# Altium project CPC-UNIFEI.PrjPcb (part 1 of 4)
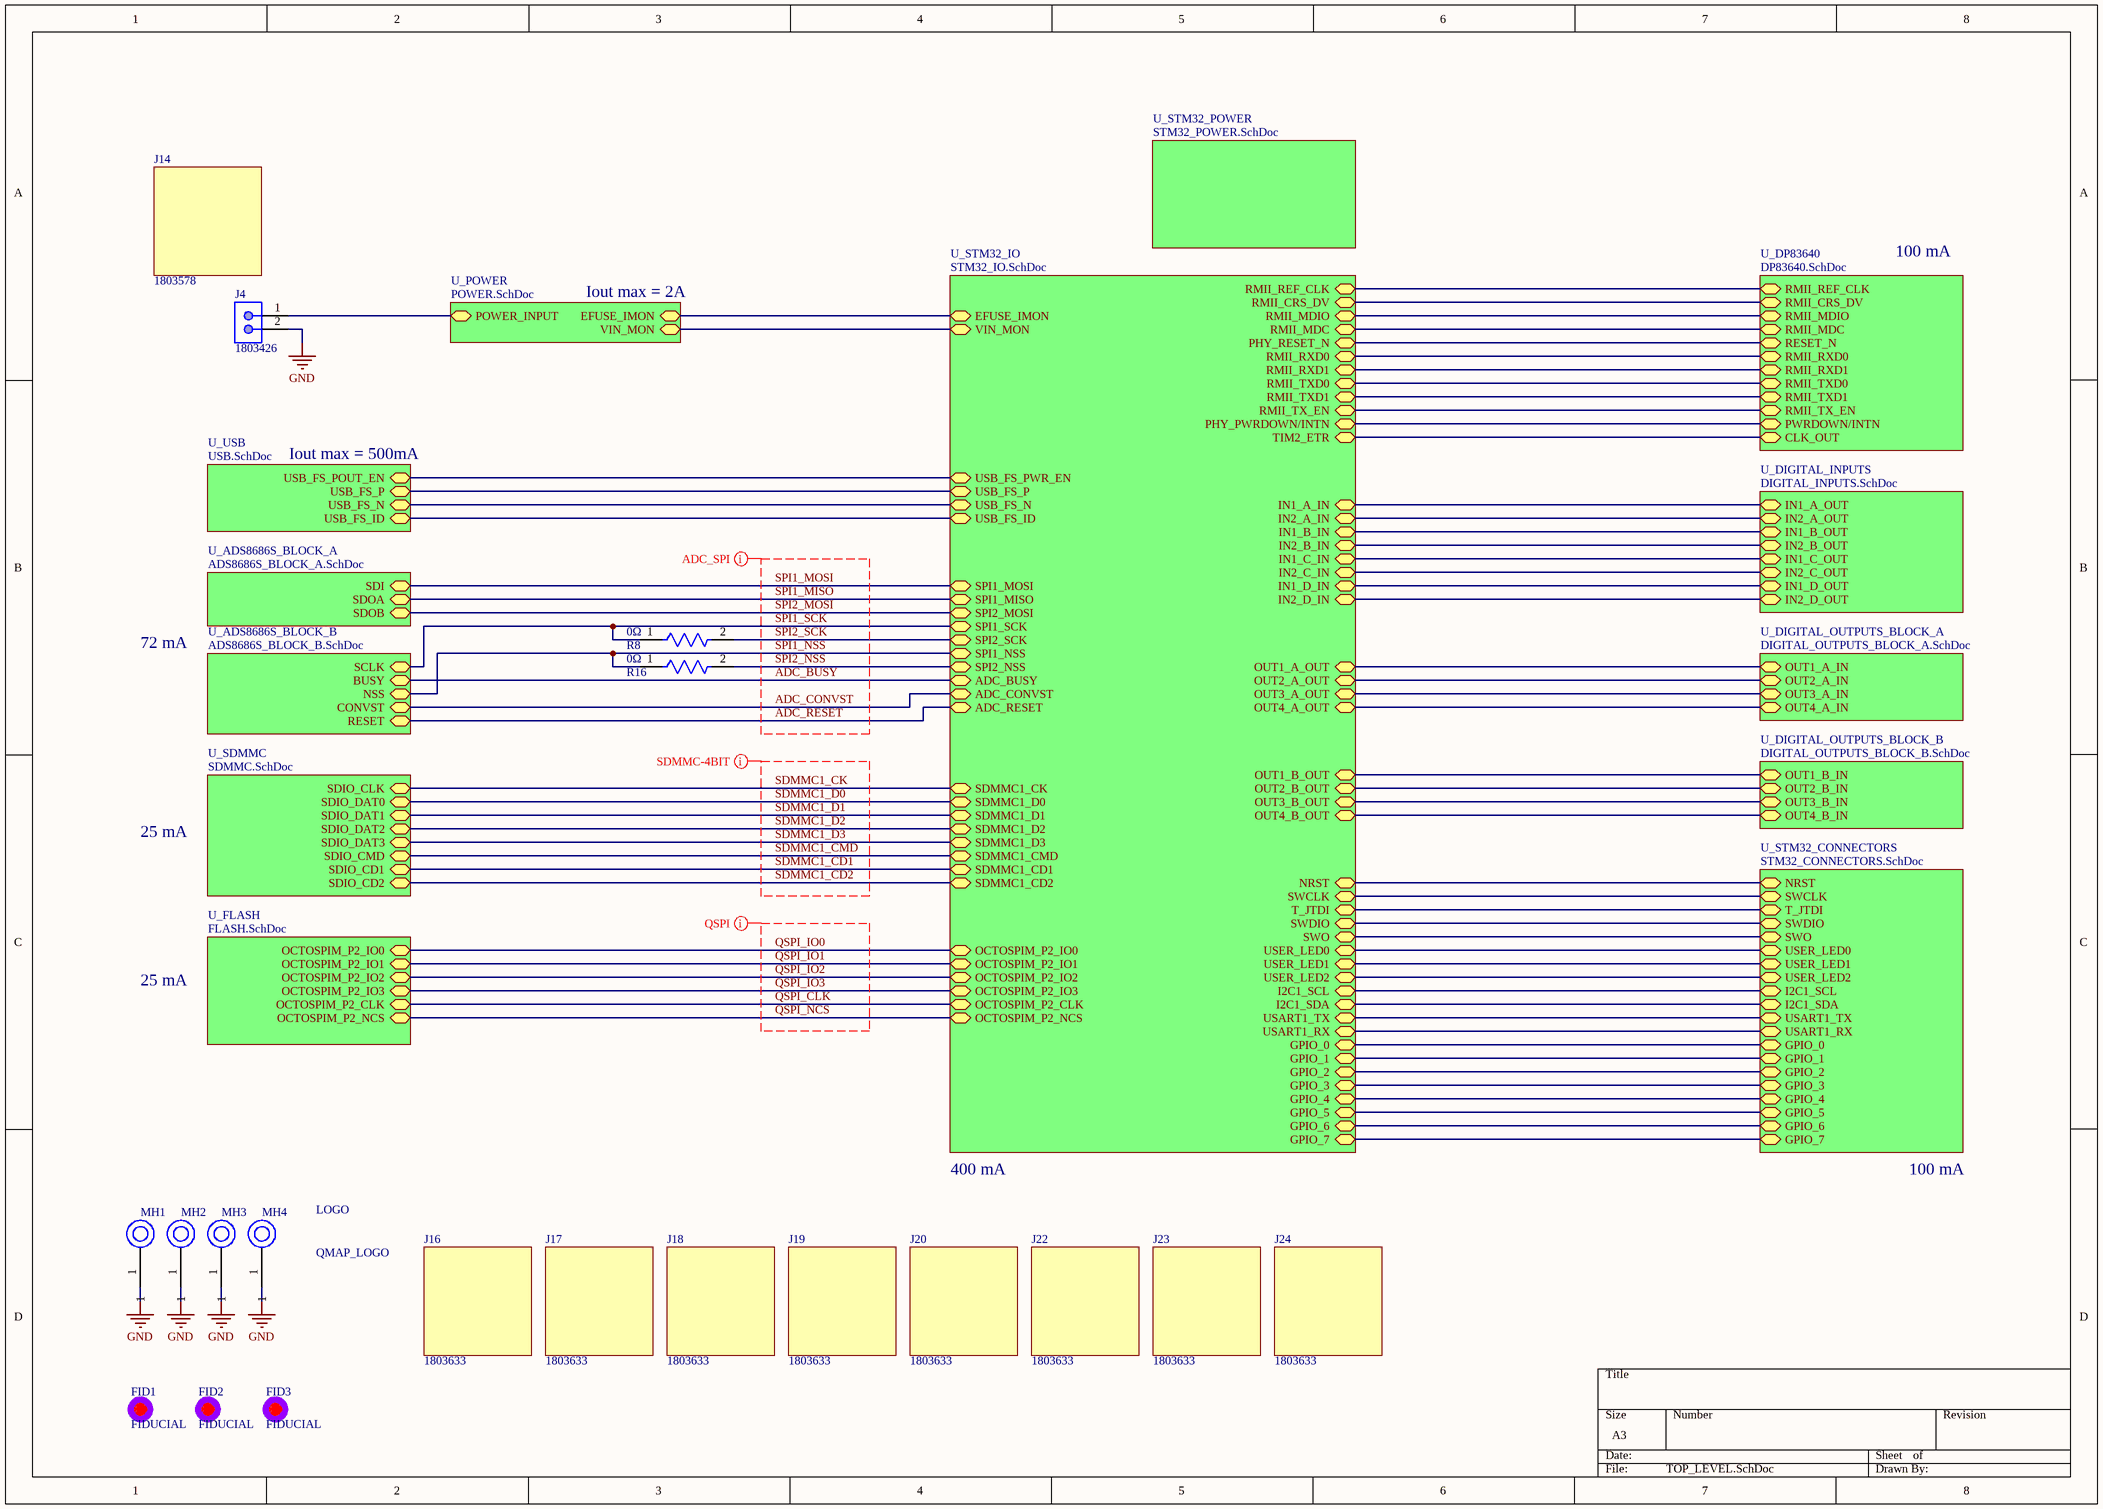
[diagram p0: TOP_LEVEL.SchDoc]
14 sheets, 403 parts. Net scope: hierarchical (ports join the sheet entries above them; power ports are global).
Board file: PCB.PcbDoc
Sheets:
  TOP_LEVEL.SchDoc
    U_POWER = POWER.SchDoc
    U_USB = USB.SchDoc
    U_STM32_IO = STM32_IO.SchDoc
    U_DP83640 = DP83640.SchDoc
    U_STM32_POWER = STM32_POWER.SchDoc
    U_DIGITAL_INPUTS = DIGITAL_INPUTS.SchDoc
    U_DIGITAL_OUTPUTS_BLOCK_A = DIGITAL_OUTPUTS_BLOCK_A.SchDoc
    U_DIGITAL_OUTPUTS_BLOCK_B = DIGITAL_OUTPUTS_BLOCK_B.SchDoc
    U_FLASH = FLASH.SchDoc
    U_ADS8686S_BLOCK_A = ADS8686S_BLOCK_A.SchDoc
    U_ADS8686S_BLOCK_B = ADS8686S_BLOCK_B.SchDoc
    U_SDMMC = SDMMC.SchDoc
    U_STM32_CONNECTORS = STM32_CONNECTORS.SchDoc

## Sheet TOP_LEVEL.SchDoc
size A3; SheetNumber: 1; SheetTotal: 14

### Parts
FID1  FIDUCIAL  [FIDUCIAL]  (no BOM)
FID2  FIDUCIAL  [FIDUCIAL]  (no BOM)
FID3  FIDUCIAL  [FIDUCIAL]  (no BOM)
J4  1803426  [PHOE-1803426_V]
J14  1803578
J16  1803633
J17  1803633
J18  1803633
J19  1803633
J20  1803633
J22  1803633
J23  1803633
J24  1803633
LOGO  QMAP_LOGO  [QMAP_LOGO]  (no BOM)
MH1  MOUNTING_HOLE  [M3HOLE]  (value not drawn)  (no BOM)
MH2  MOUNTING_HOLE  [M3HOLE]  (value not drawn)  (no BOM)
MH3  MOUNTING_HOLE  [M3HOLE]  (value not drawn)  (no BOM)
MH4  MOUNTING_HOLE  [M3HOLE]  (value not drawn)  (no BOM)
R8  Resistance: 0Ω  [FP-AC0402-IPC_B]  (hidden comment: AC0402JR-070RL)
R16  Resistance: 0Ω  [FP-AC0402-IPC_B]  (hidden comment: AC0402JR-070RL)

### Sub-sheets
U_ADS8686S_BLOCK_A = ADS8686S_BLOCK_A.SchDoc: SDI (bidir), SDOB (bidir), SDOA (bidir)
U_ADS8686S_BLOCK_B = ADS8686S_BLOCK_B.SchDoc: SCLK (bidir), BUSY (bidir), NSS (bidir), CONVST (bidir), RESET (bidir)
U_DIGITAL_INPUTS = DIGITAL_INPUTS.SchDoc: IN1_A_OUT (bidir), IN2_A_OUT (bidir), IN1_B_OUT (bidir), IN2_B_OUT (bidir), IN1_C_OUT (bidir), IN2_C_OUT (bidir), IN1_D_OUT (bidir), IN2_D_OUT (bidir)
U_DIGITAL_OUTPUTS_BLOCK_A = DIGITAL_OUTPUTS_BLOCK_A.SchDoc: OUT1_A_IN (bidir), OUT2_A_IN (bidir), OUT3_A_IN (bidir), OUT4_A_IN (bidir)
U_DIGITAL_OUTPUTS_BLOCK_B = DIGITAL_OUTPUTS_BLOCK_B.SchDoc: OUT1_B_IN (bidir), OUT2_B_IN (bidir), OUT3_B_IN (bidir), OUT4_B_IN (bidir)
U_DP83640 = DP83640.SchDoc: RMII_REF_CLK (bidir), RMII_CRS_DV (bidir), RMII_MDIO (bidir), RMII_MDC (bidir), RESET_N (bidir), RMII_RXD0 (bidir), RMII_RXD1 (bidir), RMII_TXD0 (bidir), RMII_TXD1 (bidir), RMII_TX_EN (bidir), PWRDOWN/INTN (bidir), CLK_OUT (bidir)
U_FLASH = FLASH.SchDoc: OCTOSPIM_P2_IO0 (bidir), OCTOSPIM_P2_IO1 (bidir), OCTOSPIM_P2_IO2 (bidir), OCTOSPIM_P2_IO3 (bidir), OCTOSPIM_P2_CLK (bidir), OCTOSPIM_P2_NCS (bidir)
U_POWER = POWER.SchDoc: POWER_INPUT (bidir), EFUSE_IMON (bidir), VIN_MON (bidir)
U_SDMMC = SDMMC.SchDoc: SDIO_CLK (bidir), SDIO_DAT0 (bidir), SDIO_DAT1 (bidir), SDIO_DAT2 (bidir), SDIO_DAT3 (bidir), SDIO_CMD (bidir), SDIO_CD1 (bidir), SDIO_CD2 (bidir)
U_STM32_CONNECTORS = STM32_CONNECTORS.SchDoc: NRST (bidir), SWCLK (bidir), T_JTDI (bidir), SWDIO (bidir), SWO (bidir), USER_LED0 (bidir), USER_LED1 (bidir), USER_LED2 (bidir), I2C1_SCL (bidir), I2C1_SDA (bidir), USART1_TX (bidir), USART1_RX (bidir), GPIO_0 (bidir), GPIO_1 (bidir), GPIO_2 (bidir), GPIO_3 (bidir), GPIO_4 (bidir), GPIO_5 (bidir), GPIO_6 (bidir), GPIO_7 (bidir)
U_STM32_IO = STM32_IO.SchDoc: RMII_REF_CLK (bidir), RMII_CRS_DV (bidir), RMII_MDIO (bidir), RMII_MDC (bidir), RMII_RXD0 (bidir), RMII_RXD1 (bidir), RMII_TXD0 (bidir), RMII_TXD1 (bidir), RMII_TX_EN (bidir), SPI1_MISO (bidir), SPI1_SCK (bidir), SPI1_NSS (bidir), SPI2_NSS (bidir), SPI2_SCK (bidir), USB_FS_N (bidir), USB_FS_P (bidir), USB_FS_ID (bidir), USB_FS_PWR_EN (bidir), SPI2_MOSI (bidir), SPI1_MOSI (bidir), SDMMC1_D0 (bidir), SDMMC1_D1 (bidir), SDMMC1_D2 (bidir), SDMMC1_D3 (bidir), SDMMC1_CK (bidir), SDMMC1_CMD (bidir), SDMMC1_CD1 (bidir), SDMMC1_CD2 (bidir), OCTOSPIM_P2_IO0 (bidir), OCTOSPIM_P2_IO1 (bidir), OCTOSPIM_P2_IO2 (bidir), OCTOSPIM_P2_IO3 (bidir), OCTOSPIM_P2_CLK (bidir), OCTOSPIM_P2_NCS (bidir), PHY_RESET_N (bidir), PHY_PWRDOWN/INTN (bidir), TIM2_ETR (bidir), IN1_A_IN (bidir), IN2_A_IN (bidir), IN1_B_IN (bidir), IN2_B_IN (bidir), IN1_C_IN (bidir), IN2_C_IN (bidir), IN1_D_IN (bidir), IN2_D_IN (bidir), OUT1_A_OUT (bidir), OUT2_A_OUT (bidir), OUT3_A_OUT (bidir), OUT4_A_OUT (bidir), OUT3_B_OUT (bidir), OUT4_B_OUT (bidir), OUT1_B_OUT (bidir), OUT2_B_OUT (bidir), EFUSE_IMON (bidir), VIN_MON (bidir), NRST (bidir), SWCLK (bidir), T_JTDI (bidir), SWDIO (bidir), SWO (bidir), USER_LED0 (bidir), USER_LED1 (bidir), USER_LED2 (bidir), I2C1_SCL (bidir), I2C1_SDA (bidir), USART1_TX (bidir), USART1_RX (bidir), GPIO_6 (bidir), GPIO_7 (bidir), GPIO_0 (bidir), GPIO_1 (bidir), GPIO_2 (bidir), GPIO_3 (bidir), GPIO_4 (bidir), GPIO_5 (bidir), ADC_BUSY (bidir), ADC_CONVST (bidir), ADC_RESET (bidir)
U_STM32_POWER = STM32_POWER.SchDoc: no entries
U_USB = USB.SchDoc: USB_FS_N (bidir), USB_FS_P (bidir), USB_FS_ID (bidir), USB_FS_POUT_EN (bidir)

### Nets
GND: J4.2
ADC_BUSY: sheet U_STM32_IO/ADC_BUSY, sheet U_ADS8686S_BLOCK_B/BUSY
ADC_CONVST: sheet U_STM32_IO/ADC_CONVST, sheet U_ADS8686S_BLOCK_B/CONVST
ADC_RESET: sheet U_STM32_IO/ADC_RESET, sheet U_ADS8686S_BLOCK_B/RESET
NRST: sheet U_STM32_IO/NRST, sheet U_STM32_CONNECTORS/NRST
PA0: sheet U_STM32_IO/TIM2_ETR, sheet U_DP83640/CLK_OUT
PA1: sheet U_STM32_IO/RMII_REF_CLK, sheet U_DP83640/RMII_REF_CLK
PA2: sheet U_STM32_IO/RMII_MDIO, sheet U_DP83640/RMII_MDIO
PA3: sheet U_STM32_IO/PHY_RESET_N, sheet U_DP83640/RESET_N
PA7: sheet U_STM32_IO/RMII_CRS_DV, sheet U_DP83640/RMII_CRS_DV
PA10: sheet U_USB/USB_FS_ID, sheet U_STM32_IO/USB_FS_ID
PA13: sheet U_STM32_IO/SWDIO, sheet U_STM32_CONNECTORS/SWDIO
PA14: sheet U_STM32_IO/SWCLK, sheet U_STM32_CONNECTORS/SWCLK
PA15: sheet U_STM32_IO/T_JTDI, sheet U_STM32_CONNECTORS/T_JTDI
PB0: sheet U_STM32_IO/USER_LED0, sheet U_STM32_CONNECTORS/USER_LED0
PB1: sheet U_STM32_IO/USER_LED1, sheet U_STM32_CONNECTORS/USER_LED1
PB2: sheet U_STM32_IO/USER_LED2, sheet U_STM32_CONNECTORS/USER_LED2
PB3: sheet U_STM32_IO/SWO, sheet U_STM32_CONNECTORS/SWO
PB6: sheet U_STM32_IO/I2C1_SCL, sheet U_STM32_CONNECTORS/I2C1_SCL
PB7: sheet U_STM32_IO/I2C1_SDA, sheet U_STM32_CONNECTORS/I2C1_SDA
PB8: sheet U_STM32_IO/GPIO_0, sheet U_STM32_CONNECTORS/GPIO_0
PB9: sheet U_STM32_IO/GPIO_1, sheet U_STM32_CONNECTORS/GPIO_1
PB11: sheet U_STM32_IO/RMII_TX_EN, sheet U_DP83640/RMII_TX_EN
PB12: sheet U_STM32_IO/RMII_TXD0, sheet U_DP83640/RMII_TXD0
PB13: sheet U_STM32_IO/RMII_TXD1, sheet U_DP83640/RMII_TXD1
PB14: sheet U_STM32_IO/USART1_TX, sheet U_STM32_CONNECTORS/USART1_TX
PB15: sheet U_STM32_IO/USART1_RX, sheet U_STM32_CONNECTORS/USART1_RX
PC1: sheet U_STM32_IO/RMII_MDC, sheet U_DP83640/RMII_MDC
PC2: sheet U_STM32_IO/PHY_PWRDOWN/INTN, sheet U_DP83640/PWRDOWN/INTN
PC4: sheet U_STM32_IO/RMII_RXD0, sheet U_DP83640/RMII_RXD0
PC5: sheet U_STM32_IO/RMII_RXD1, sheet U_DP83640/RMII_RXD1
PD0: sheet U_STM32_IO/OUT1_A_OUT, sheet U_DIGITAL_OUTPUTS_BLOCK_A/OUT1_A_IN
PD1: sheet U_STM32_IO/OUT4_A_OUT, sheet U_DIGITAL_OUTPUTS_BLOCK_A/OUT4_A_IN
PD3: sheet U_STM32_IO/OUT3_A_OUT, sheet U_DIGITAL_OUTPUTS_BLOCK_A/OUT3_A_IN
PD4: sheet U_STM32_IO/OUT2_A_OUT, sheet U_DIGITAL_OUTPUTS_BLOCK_A/OUT2_A_IN
PD5: sheet U_STM32_IO/OUT1_B_OUT, sheet U_DIGITAL_OUTPUTS_BLOCK_B/OUT1_B_IN
PD6: sheet U_STM32_IO/OUT3_B_OUT, sheet U_DIGITAL_OUTPUTS_BLOCK_B/OUT3_B_IN
PD10: sheet U_USB/USB_FS_POUT_EN, sheet U_STM32_IO/USB_FS_PWR_EN
PE0: sheet U_STM32_IO/GPIO_2, sheet U_STM32_CONNECTORS/GPIO_2
PE1: sheet U_STM32_IO/GPIO_3, sheet U_STM32_CONNECTORS/GPIO_3
PE2: sheet U_STM32_IO/GPIO_4, sheet U_STM32_CONNECTORS/GPIO_4
PE3: sheet U_STM32_IO/GPIO_5, sheet U_STM32_CONNECTORS/GPIO_5
PE4: sheet U_STM32_IO/GPIO_6, sheet U_STM32_CONNECTORS/GPIO_6
PE5: sheet U_STM32_IO/GPIO_7, sheet U_STM32_CONNECTORS/GPIO_7
PE7: sheet U_STM32_IO/IN2_C_IN, sheet U_DIGITAL_INPUTS/IN2_C_OUT
PE8: sheet U_STM32_IO/IN1_D_IN, sheet U_DIGITAL_INPUTS/IN1_D_OUT
PE9: sheet U_STM32_IO/IN2_D_IN, sheet U_DIGITAL_INPUTS/IN2_D_OUT
PF11: sheet U_POWER/VIN_MON, sheet U_STM32_IO/VIN_MON
PF12: sheet U_POWER/EFUSE_IMON, sheet U_STM32_IO/EFUSE_IMON
PF13: sheet U_STM32_IO/IN1_A_IN, sheet U_DIGITAL_INPUTS/IN1_A_OUT
PF14: sheet U_STM32_IO/IN2_A_IN, sheet U_DIGITAL_INPUTS/IN2_A_OUT
PF15: sheet U_STM32_IO/IN1_B_IN, sheet U_DIGITAL_INPUTS/IN1_B_OUT
PG0: sheet U_STM32_IO/IN2_B_IN, sheet U_DIGITAL_INPUTS/IN2_B_OUT
PG1: sheet U_STM32_IO/IN1_C_IN, sheet U_DIGITAL_INPUTS/IN1_C_OUT
PG9: sheet U_STM32_IO/OUT2_B_OUT, sheet U_DIGITAL_OUTPUTS_BLOCK_B/OUT2_B_IN
PG10: sheet U_STM32_IO/OUT4_B_OUT, sheet U_DIGITAL_OUTPUTS_BLOCK_B/OUT4_B_IN
POWER_INPUT: J4.1 ; sheet U_POWER/POWER_INPUT
QSPI_CLK: sheet U_STM32_IO/OCTOSPIM_P2_CLK, sheet U_FLASH/OCTOSPIM_P2_CLK  [project net PF4]
QSPI_IO0: sheet U_STM32_IO/OCTOSPIM_P2_IO0, sheet U_FLASH/OCTOSPIM_P2_IO0  [project net PF0]
QSPI_IO1: sheet U_STM32_IO/OCTOSPIM_P2_IO1, sheet U_FLASH/OCTOSPIM_P2_IO1  [project net PF1]
QSPI_IO2: sheet U_STM32_IO/OCTOSPIM_P2_IO2, sheet U_FLASH/OCTOSPIM_P2_IO2  [project net PF2]
QSPI_IO3: sheet U_STM32_IO/OCTOSPIM_P2_IO3, sheet U_FLASH/OCTOSPIM_P2_IO3  [project net PF3]
QSPI_NCS: sheet U_STM32_IO/OCTOSPIM_P2_NCS, sheet U_FLASH/OCTOSPIM_P2_NCS  [project net PG12]
SDMMC1_CD1: sheet U_STM32_IO/SDMMC1_CD1, sheet U_SDMMC/SDIO_CD1  [project net PC7]
SDMMC1_CD2: sheet U_STM32_IO/SDMMC1_CD2, sheet U_SDMMC/SDIO_CD2  [project net PC6]
SDMMC1_CK: sheet U_STM32_IO/SDMMC1_CK, sheet U_SDMMC/SDIO_CLK  [project net PC12]
SDMMC1_CMD: sheet U_STM32_IO/SDMMC1_CMD, sheet U_SDMMC/SDIO_CMD  [project net PD2]
SDMMC1_D0: sheet U_STM32_IO/SDMMC1_D0, sheet U_SDMMC/SDIO_DAT0  [project net PC8]
SDMMC1_D1: sheet U_STM32_IO/SDMMC1_D1, sheet U_SDMMC/SDIO_DAT1  [project net PC9]
SDMMC1_D2: sheet U_STM32_IO/SDMMC1_D2, sheet U_SDMMC/SDIO_DAT2  [project net PC10]
SDMMC1_D3: sheet U_STM32_IO/SDMMC1_D3, sheet U_SDMMC/SDIO_DAT3  [project net PC11]
SPI1_MISO: sheet U_STM32_IO/SPI1_MISO, sheet U_ADS8686S_BLOCK_A/SDOA  [project net PA6]
SPI1_MOSI: sheet U_STM32_IO/SPI1_MOSI, sheet U_ADS8686S_BLOCK_A/SDI  [project net PD7]
SPI1_NSS: R16.1 ; sheet U_STM32_IO/SPI1_NSS, sheet U_ADS8686S_BLOCK_B/NSS  [project net PA4]
SPI1_SCK: R8.1 ; sheet U_STM32_IO/SPI1_SCK, sheet U_ADS8686S_BLOCK_B/SCLK  [project net PA5]
SPI2_MOSI: sheet U_STM32_IO/SPI2_MOSI, sheet U_ADS8686S_BLOCK_A/SDOB  [project net PC3]
SPI2_NSS: R16.2 ; sheet U_STM32_IO/SPI2_NSS  [project net PB4]
SPI2_SCK: R8.2 ; sheet U_STM32_IO/SPI2_SCK  [project net PB10]
USB_FS_N: sheet U_USB/USB_FS_N, sheet U_STM32_IO/USB_FS_N
USB_FS_P: sheet U_USB/USB_FS_P, sheet U_STM32_IO/USB_FS_P

Not connected (* = marked no-connect by the designer): MH1 1; MH2 1; MH3 1; MH4 1

### Layout directives
rule Width Constraint [Pref Impedance = 50.00ohms    Min Impedance = 50.00ohms    Max Impedance = 50.00ohms]; net class ADC_SPI: ADC_BUSY, ADC_CONVST, ADC_RESET, SPI1_MISO, SPI1_MOSI, SPI1_NSS, SPI1_SCK, SPI2_MOSI, SPI2_NSS, SPI2_SCK
rule Width Constraint [Pref Impedance = 50.00ohms    Min Impedance = 50.00ohms    Max Impedance = 50.00ohms]; net class SDMMC: SDMMC1_CD1, SDMMC1_CD2, SDMMC1_CK, SDMMC1_CMD, SDMMC1_D0, SDMMC1_D1, SDMMC1_D2, SDMMC1_D3
rule Width Constraint [Pref Impedance = 50.00ohms    Min Impedance = 50.00ohms    Max Impedance = 50.00ohms]; net class QSPI: QSPI_CLK, QSPI_IO0, QSPI_IO1, QSPI_IO2, QSPI_IO3, QSPI_NCS

### Notes on the sheet
- Iout max = 2A
- 100 mA
- Iout max = 500mA
- 72 mA
- 25 mA
- 400 mA

### Library data of the parts
J4 = CMP-2000-05826-1: Male Header, Pitch 3.81 mm, 1 x 2 Position, Height 9.2 mm, Tail Length 3.4 mm; Manufacturer: Phoenix Contact; Manufacturer URL: http://www.phoenixcontact.com/; Datasheet Version: 02/2015; Mounting Technology: ThroughHole; Package Description: Male Header, Pitch 3.81 mm, 1 x 2 Position, Height 9.2 mm; Datasheet URL: https://www.phoenixcontact.com/online/portal/cn/pxc/product_detail_page/!ut/p/b1/3VfHjrNIGHyWeQDG5HAkm5zjxQIM2AQDNvnp1zNa7WFX889l5YPpA6L1qUtVdFX3d4gPEYCiFAaBJHgID_Etma9lMl67W9J8fcf4iRJ1HIRRHAIZDANpTKVtR3IFAyUOwSEE0ZNTbb2iOquuOqg8OKsEReRD0XpT8cAJtHK1h62gd5Lwwj7fSR7gfNZiWNE2tu2Xg71pvaHw3VHbDIccysUbixteZxggMWJnxWgP9KIolKko13HrKNI0OD69xjcsLwZb9oJmcNi4flh1xw9LW6-eWTQ9nREGMg82nQ7i5d6Jdk07dw7fZbrokLagaoyYggEvB4C7H5W4HERjSAam7I1pSvC1iqzSu8itk8CidtE6n3bP2nD0Pp6iRD-LQiLob5pFzwLixwIWO7iH0PcgleukhedgldkYbrFLA5WSM7ufG5_qGPkUc9vEzZQaS901mlWkPYn5tWxhabkCUfW4SsSIbpPuMIJHpQReslhERyEnqVrZBIU1V5Nilrs5X123FVtC3BVOSLHMP1b6PfXsNSgk1T-F50SEmtzqQUXqhsW5rwQ1o0BXB2gELrcQ4gCUoNAFTBX6N2LEmxJz0Hclhr8rsXf1mPOuHoPf1WPwu3oMflePSW-7Fd81PGj4i1jqc2r6kGnO3K4b7QxsE14hAduG8C7FaT2GvZ7I-s0j05SGAI1kaO9y99Mt55acg9cLDNYaWwQcdDTPAtjrfMY1OBkOcVEr9HZ8tGspIQLbIVDtpjctgzHFMG4BAZsGvQthBBH4WA-nFo17BJ08nhvnnSIvtClxxDZLZLDt43EXgXAD-FUl6xp1LReX8w3Sb-3dEFiLergsTPmiPWlKHKTnUE9MvjMWis8MoKAxhXcLRQoyR1OjaJFnuS2q9AQSlWi71_PQS1I7hwNcTAR9vGjIY_k4yIf4mrafS9Z-gp_9mn329-4; Package Reference: 1803426
J14 = 1803578: Plug, Terminal Block; 8 A; 160 V; 3.81 mm; 2; Screw; 2.5 kV; 160 V; Polyamide; Manufacturer: Phoenix Contact; Number of Positions: 2; Current Rating: 8A; Gender: Male; Voltage Rating (AC): 160V; Connector Type: Screw,Power,Rectangular; Number of Levels: 1; Voltage: 300V; Pitch: 3.81mm; Wire Gauge (Max): 30AWG; Wire Gauge (Min): 14AWG; Wire/Cable Gauge: 16AWG; Stripping Length: 7mm; Approvals: UL,CSA,VDE; Supplier: Rs; Supplier Part Number: 2204658; Manufacturer Part Number: 1803578; RoHS: Yes; Category: Terminal Blocks; Stock: 1335; Pricing: 5=2.048, 75=1.866, 250=1.702, 500=1.57, 1000=1.448 (GBP); Mounting Technology: Free Hanging,Cable; Contact Material: Tin; Contact Plating: Tin; Housing Color: Green; Housing Material: Polyamide; Color: Green; Weight: 3.456848oz; Insulation Material: Nylon; Min Operating Temperature: -40°C; Max Operating Temperature: 100°C; Package Quantity: 50; Packaging: Bulk; Termination: Screw; Orientation: Right Angle; Series: MC; Number of Poles: 2; Number of Rows: 1; Max Current Rating: 8A; Number of Contacts: 2; Voltage Rating: 160V; Number of Positions Per Level: 2; Current: 8A; Max Supply Voltage: 160V; Number of Circuits: 2; Voltage Rating (DC): 160V; Length: 8.41mm; Width: 16.1mm; Height: 11.1mm; Depth: 16.1mm; Radiation Hardening: No; Lead Free: Lead Free; RoHS Compliant: Yes; Reach SVHC Compliant: No; Flammability Rating: UL94 V-0; ComponentLink1URL: https://datasheet.ciiva.com/795/1803578-795460.pdf?src-supplier=Digikey; ComponentLink1Description: https://datasheet.ciiva.com/795/1803578-795460.pdf?src-supplier=Digikey; ComponentLink2URL: https://datasheet.ciiva.com/16046/1803578-16046760.pdf?src-supplier=Onlinecomponents.com; ComponentLink2Description: https://datasheet.ciiva.com/16046/1803578-16046760.pdf?src-supplier=Onlinecomponents.com; ComponentLink3URL: https://datasheet.ciiva.com/29224/740200-da-01-en-leiterplattenstecker-mc-1-5-2-st-3-81-29224613.pdf?src-supplier=Conrad; ComponentLink3Description: https://datasheet.ciiva.com/29224/740200-da-01-en-leiterplattenstecker-mc-1-5-2-st-3-81-29224613.pdf?src-supplier=Conrad; Supplier 1: Rs; Supplier Part Number 1: 2204658
J16-J20 J22-J24 = 1803633: Plug, Terminal Block; 8 A; 160 V; 3.81 mm; 8; Screw; 2.5 kV; 160 V; Polyamide; Manufacturer: Phoenix Contact; Gender: Male; Number of Positions: 8; Current Rating: 8A; Voltage Rating: 160V; Number of Levels: 1; Voltage: 300V; Wire Gauge (Max): 30AWG; Wire Gauge (Min): 14AWG; Wire/Cable Gauge: 28AWG; Pitch: 3.81mm; Stripping Length: 7mm; Thread Size: M2; Approvals: UL,CSA,VDE,cULus,CB,EAC; Supplier 1: Rs; Supplier Part Number 1: 2204709; Supplier: Rs; Supplier Part Number: 2204709; Manufacturer Part Number: 1803633; RoHS: Yes; Category: Terminal Blocks; Stock: 1540; Pricing: 5=7.832, 125=7.048, 375=6.266, 1000=5.474, 2000=5.09 (GBP); Mounting Technology: Free Hanging,Cable; Contact Plating: Tin; Contact Material: Tin; Color: Green; Weight: 3.456848oz; Material: Nylon; Housing Color: Green; Housing Material: Polyamide; Insulation Material: Nylon; Packaging: Bulk; Series: MC; Number of Rows: 1; Package Quantity: 50; Termination: Screw; Number of Poles: 8; Max Current Rating: 8A; Max Supply Voltage: 160V; Number of Positions Per Level: 8; Current: 8A; Number of Contacts: 8; Number of Circuits: 8; Orientation: Right Angle; Connector Type: Screw; Voltage Rating (DC): 160V; Number of Ways: 8; Length: 31.27mm; Width: 31.27mm; Height: 11.1mm; Depth: 16.1mm; Radiation Hardening: No; RoHS Compliant: Yes; Reach SVHC Compliant: No; Lead Free: Lead Free; Flammability Rating: UL94 V-0; ComponentLink1URL: https://datasheet.ciiva.com/795/1803633-795565.pdf?src-supplier=Digikey; ComponentLink1Description: https://datasheet.ciiva.com/795/1803633-795565.pdf?src-supplier=Digikey; ComponentLink2URL: https://datasheet.ciiva.com/16071/1803633-16071208.pdf?src-supplier=Onlinecomponents.com; ComponentLink2Description: https://datasheet.ciiva.com/16071/1803633-16071208.pdf?src-supplier=Onlinecomponents.com; ComponentLink3URL: https://datasheet.ciiva.com/15169/getdatasheetpartid-177866-15169646.pdf?src-supplier=Verical; ComponentLink3Description: https://datasheet.ciiva.com/15169/getdatasheetpartid-177866-15169646.pdf?src-supplier=Verical; ComponentLink4URL: https://datasheet.ciiva.com/8032/100951-8032830.pdf?src-supplier=Element14; ComponentLink4Description: https://datasheet.ciiva.com/8032/100951-8032830.pdf?src-supplier=Element14; ComponentLink5URL: https://datasheet.ciiva.com/29224/740320-da-01-en-leiterplattenstecker-mc-1-5-8-st-3-81-29224629.pdf?src-supplier=Conrad; ComponentLink5Description: https://datasheet.ciiva.com/29224/740320-da-01-en-leiterplattenstecker-mc-1-5-8-st-3-81-29224629.pdf?src-supplier=Conrad; ComponentLink6URL: https://datasheet.ciiva.com/33105/1803633-33105740.pdf?src-supplier=Today+Components; ComponentLink6Description: https://datasheet.ciiva.com/33105/1803633-33105740.pdf?src-supplier=Today+Components
R8 R16 = CMP-2002-01838-3: RES 0Ω 0.00% 0.063W 0402; Temperature Coefficient: 200ppm/°C; Voltage Rating: 50V; Max Power Dissipation: 63mW; Power Rating: 62.5mW; Tolerance: 5%; Min Operating Temperature: -55°C; RoHS Compliant: Yes; Width: 0.02inch; Height: 0.015inch; Size Code: 0402; Lead Free: Lead Free; Termination: SMD/SMT; Ratings: AEC-Q200; Package Quantity: 1; Number of Terminations: 2; Case Code (Metric): 1005; Case Code (Imperial): 0402; Resistor Type: Thick Film; Features: Moisture Resistant; Length: 0.039inch; Max Operating Temperature: 155°C; Packaging: Tape and Reel; Series: AC; Case/Package: 0402

## Sheet POWER.SchDoc
size A3; SheetNumber: 12; SheetTotal: 14
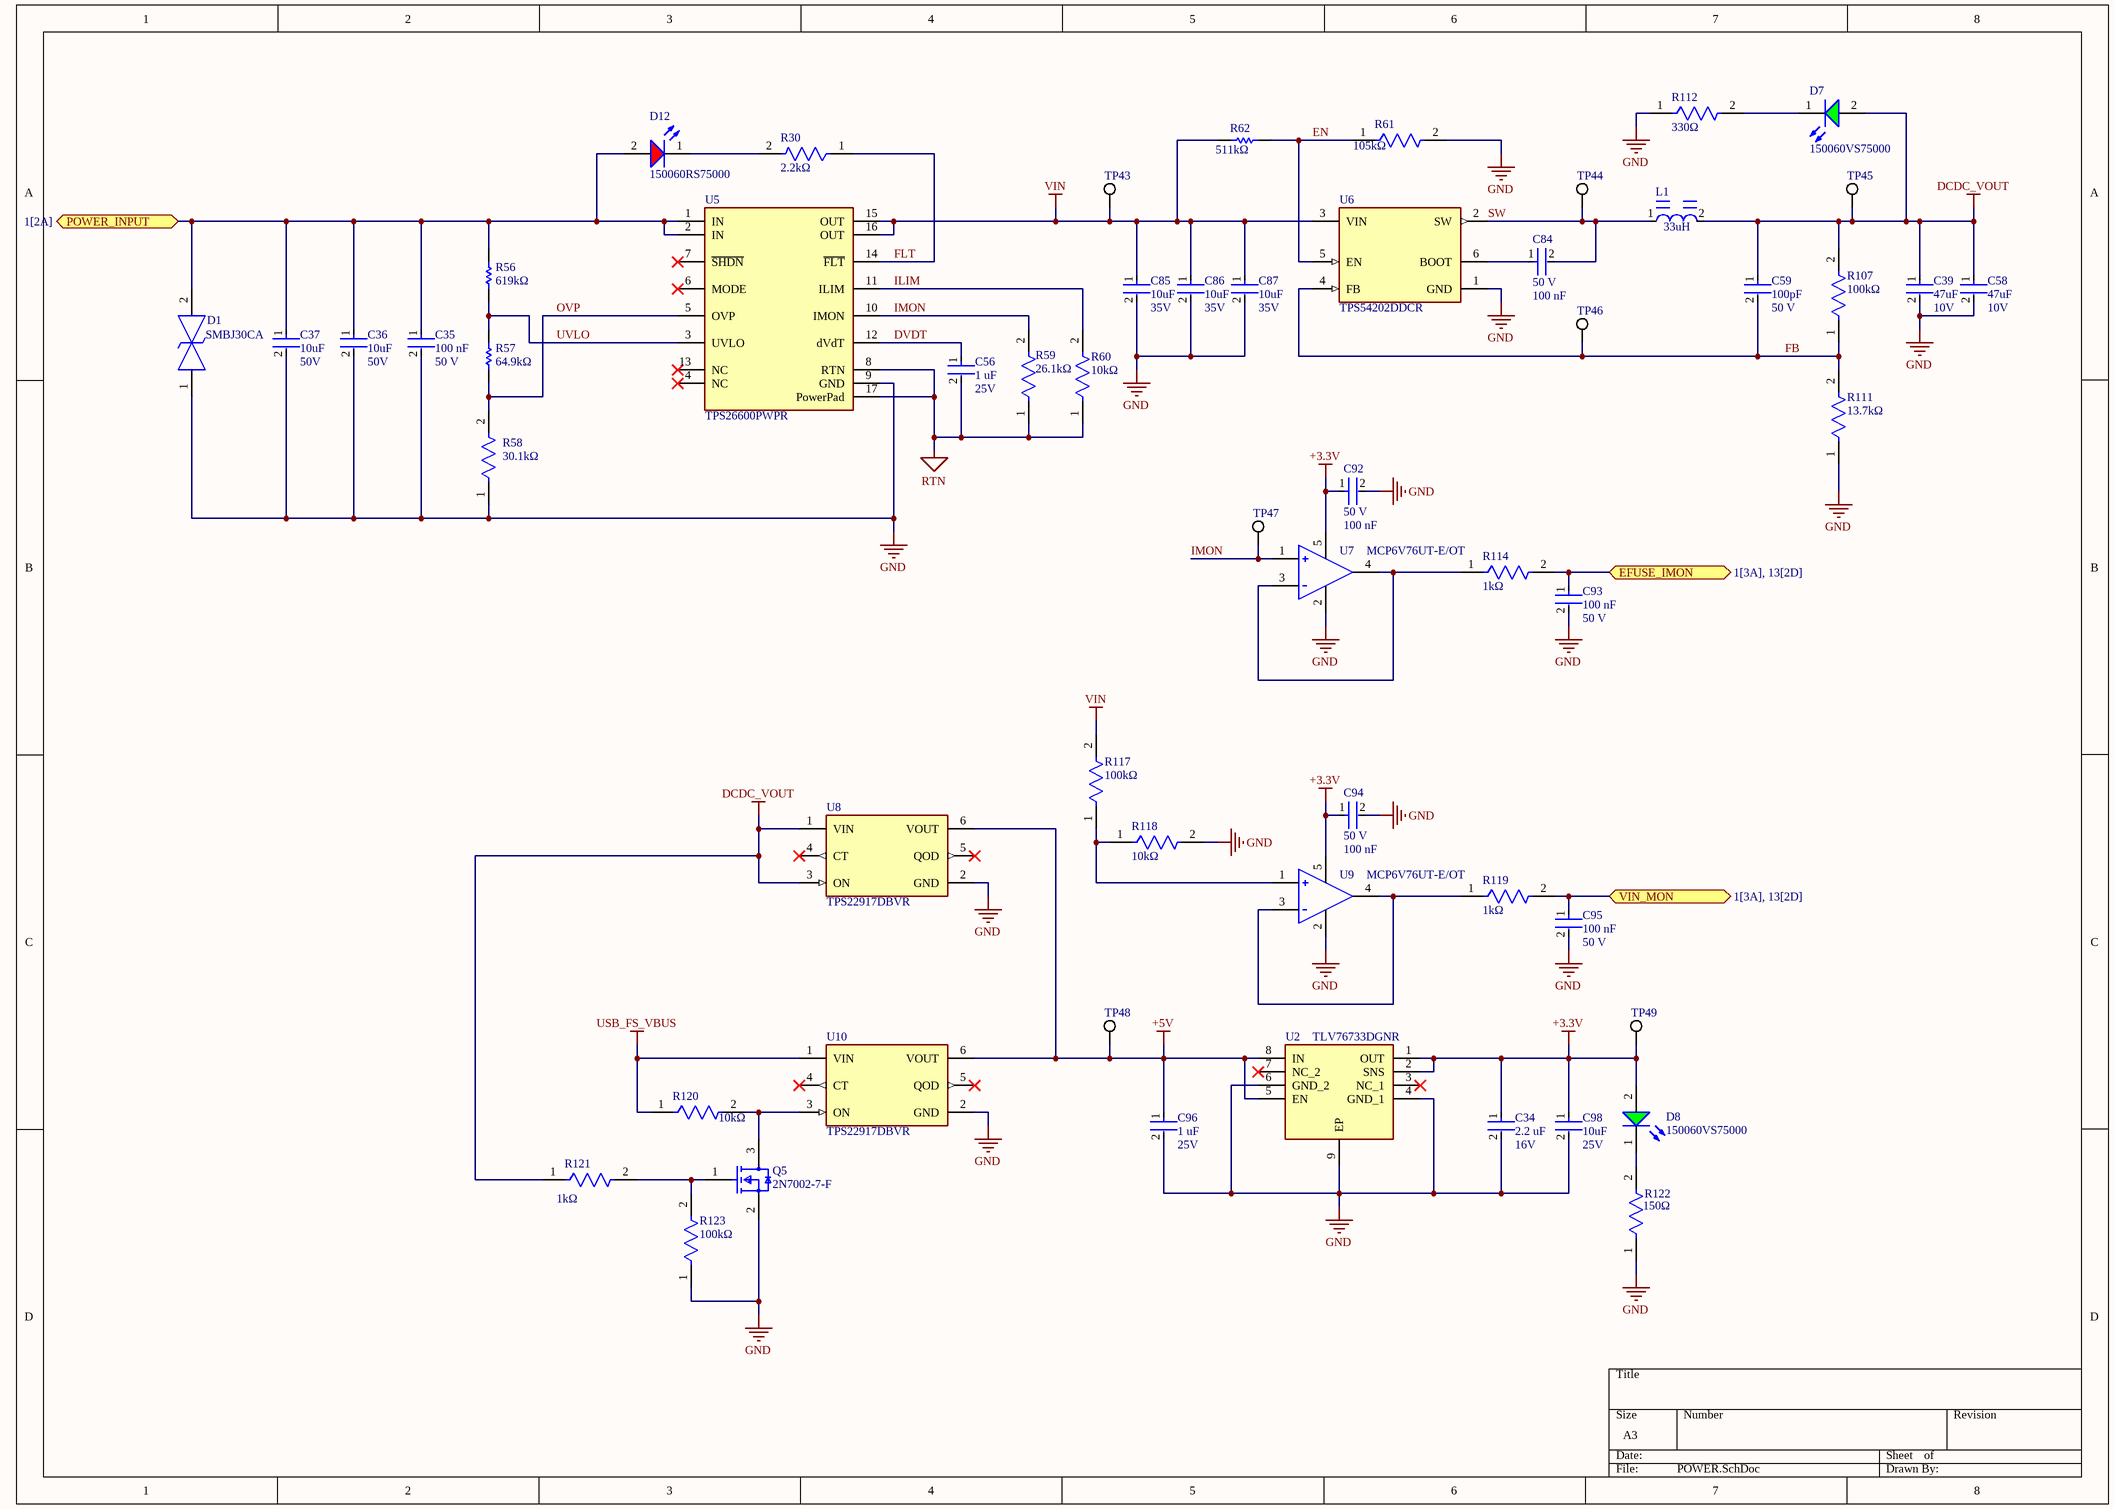
[diagram p1: POWER.SchDoc]

### Parts
C34  Capacitance: 2.2 uF  Voltage Rating: 16V  [FP-CL10-IPC_B]  (hidden comment: CL10A225KO8NNNC)
C35  value 100 nF  Voltage Rating: 50 V  [FP-C0603C-CF-IPC_B]  (hidden comment: C0603C104M5RACTU)
C36  Voltage: 50V  Capacitance: 10uF  [FP-CL31-IPC_B]  (hidden comment: CL31A106KBHNNNE)
C37  Voltage: 50V  Capacitance: 10uF  [FP-CL31-IPC_B]  (hidden comment: CL31A106KBHNNNE)
C39  Voltage Rating: 10V  Capacitance: 47uF  [FP-GRM32E-0_3-0_2-IPC_B]  (hidden comment: GRM32ER71A476KE15L)
C56  Capacitance: 1 uF  Voltage Rating: 25V  [FP-GCM188-0_1-IPC_B]  (hidden comment: GCM188R71E105KA64D)
C58  Voltage Rating: 10V  Capacitance: 47uF  [FP-GRM32E-0_3-0_2-IPC_B]  (hidden comment: GRM32ER71A476KE15L)
C59  Voltage Rating: 50 V  Capacitance: 100pF  [FP-C0603C-CF-IPC_B]  (hidden comment: C0603C101J5GACTU)
C84  value 100 nF  Voltage Rating: 50 V  [FP-C0603C-CF-IPC_B]  (hidden comment: C0603C104M5RACTU)
C85  Capacitance: 10uF  Voltage Rating: 35V  [FP-GRM21B-0_2-e0_2_0_7-IPC_B]  (hidden comment: GRM21BR6YA106KE43L)
C86  Capacitance: 10uF  Voltage Rating: 35V  [FP-GRM21B-0_2-e0_2_0_7-IPC_B]  (hidden comment: GRM21BR6YA106KE43L)
C87  Capacitance: 10uF  Voltage Rating: 35V  [FP-GRM21B-0_2-e0_2_0_7-IPC_B]  (hidden comment: GRM21BR6YA106KE43L)
C92  value 100 nF  Voltage Rating: 50 V  [FP-C0603C-CF-IPC_B]  (hidden comment: C0603C104M5RACTU)
C93  value 100 nF  Voltage Rating: 50 V  [FP-C0603C-CF-IPC_B]  (hidden comment: C0603C104M5RACTU)
C94  value 100 nF  Voltage Rating: 50 V  [FP-C0603C-CF-IPC_B]  (hidden comment: C0603C104M5RACTU)
C95  value 100 nF  Voltage Rating: 50 V  [FP-C0603C-CF-IPC_B]  (hidden comment: C0603C104M5RACTU)
C96  Capacitance: 1 uF  Voltage Rating: 25V  [FP-GCM188-0_1-IPC_B]  (hidden comment: GCM188R71E105KA64D)
C98  Voltage Rating: 25V  Capacitance: 10uF  [FP-C1608-080-IPC_B]  (hidden comment: C1608X5R1E106M080AC)
D1  SMBJ30CA  [DIOM5436X244N]
D7  150060VS75000  [WL-SMCW_0603_150060xx75000]
D8  150060VS75000  [WL-SMCW_0603_150060xx75000]
D12  150060RS75000  [WL-SMCW_0603_150060xx75000]
L1  Inductance: 33uH  [FP-SRR1280-MFG]  (hidden comment: SRR1280-330M)
Q5  2N7002-7-F  [FP-SOT23-IPC_A]
R30  Resistance: 2.2kΩ  [FP-AC0603-IPC_B]  (hidden comment: AC0603FR-072K2L)
R56  Resistance: 619kΩ  [RESC1608X55X30ML15T15]  (hidden comment: ERJ-3EKF6193V)
R57  Resistance: 64.9kΩ  [RESC1608X55X30ML15T15]  (hidden comment: ERJ-3EKF6492V)
R58  Resistance: 30.1kΩ  [FP-ERJ3EK-IPC_B]  (hidden comment: ERJ-3EKF3012V)
R59  Resistance: 26.1kΩ  [FP-CRCW0603-e3-IPC_B]  (hidden comment: CRCW060326K1FKEA)
R60  Resistance: 10kΩ  [FP-RC0603-0_55-IPC_B]  (hidden comment: RC0603FR-0710KL)
R61  Resistance: 105kΩ  [FP-RC0603-0_55-IPC_B]  (hidden comment: RC0603FR-07105KL)
R62  Resistance: 511kΩ  [RESC1608X55X25ML10T15]  (hidden comment: RC0603FR-07511KL)
R107  Resistance: 100kΩ  [FP-CRCW0603-e3-IPC_B]  (hidden comment: CRCW0603100KFKEC)
R111  Resistance: 13.7kΩ  [FP-ERJ3EK-IPC_B]  (hidden comment: ERJ-3EKF1372V)
R112  Resistance: 330Ω  [FP-CRCW0603-e3-MFG]  (hidden comment: CRCW0603330RFKEA)
R114  Resistance: 1kΩ  [FP-AC0603-IPC_B]  (hidden comment: AC0603FR-071KL)
R117  Resistance: 100kΩ  [FP-CRCW0603-e3-IPC_B]  (hidden comment: CRCW0603100KFKEC)
R118  Resistance: 10kΩ  [FP-RC0603-0_55-IPC_B]  (hidden comment: RC0603FR-0710KL)
R119  Resistance: 1kΩ  [FP-AC0603-IPC_B]  (hidden comment: AC0603FR-071KL)
R120  Resistance: 10kΩ  [FP-RC0603-0_55-IPC_B]  (hidden comment: RC0603FR-0710KL)
R121  Resistance: 1kΩ  [FP-AC0603-IPC_B]  (hidden comment: AC0603FR-071KL)
R122  Resistance: 150Ω  [FP-CRCW0603-e3-IPC_B]  (hidden comment: CRCW0603150RFKEA)
R123  Resistance: 100kΩ  [FP-CRCW0603-e3-IPC_B]  (hidden comment: CRCW0603100KFKEC)
TP43  5019  [KSTN-5019_V]  (value not drawn)
TP44  5019  [KSTN-5019_V]  (value not drawn)
TP45  5019  [KSTN-5019_V]  (value not drawn)
TP46  5019  [KSTN-5019_V]  (value not drawn)
TP47  5019  [KSTN-5019_V]  (value not drawn)
TP48  5019  [KSTN-5019_V]  (value not drawn)
TP49  5019  [KSTN-5019_V]  (value not drawn)
U2  TLV76733DGNR  [SOP65P490X110-9N]
U5  TPS26600PWPR  [FP-PWP0016H-IPC_A]
U6  TPS54202DDCR  [FP-DDC0006A-MFG]
U7  MCP6V76UT-E/OT  [FP-C04-091-OT-MFG]
U8  TPS22917DBVR  [FP-DBV0006A-MFG]
U9  MCP6V76UT-E/OT  [FP-C04-091-OT-MFG]
U10  TPS22917DBVR  [FP-DBV0006A-MFG]

### Ports
EFUSE_IMON (bidir, see 1[3A], 13[2D]), POWER_INPUT (bidir, see 1[2A]), VIN_MON (bidir, see 1[3A], 13[2D])

### Nets
+3.3V: C34.1 C92.1 C94.1 C98.1 D8.2(A) TP49.1 U2.1(OUT) U2.2(SNS) U7.5(VDD) U9.5(VDD)
+5V: C96.1 TP48.1 U2.5(EN) U2.8(IN) U8.6(VOUT) U10.6(VOUT)
DCDC_VOUT: C39.1 C58.1 C59.1 D7.2(A) L1.2 R107.2 R121.1 TP45.1 U8.1(VIN) U8.3(ON)
GND: C34.2 C35.2 C36.2 C37.2 C39.2 C58.2 C85.2 C86.2 C87.2 C92.2 C93.2 C94.2 C95.2 C96.2 C98.2 D1.1 Q5.2(S) R58.1 R61.2 R111.1 R112.1 R118.2 R122.1 R123.1 U2.4(GND_1) U2.6(GND_2) U2.9(EP) U5.9(GND) U6.1(GND) U7.2(VSS) U8.2(GND) U9.2(VSS) U10.2(GND)
RTN: C56.2 R59.1 R60.1 U5.8(RTN) U5.17(PowerPad)
USB_FS_VBUS: R120.1 U10.1(VIN)
VIN: C85.1 C86.1 C87.1 R62.1 R117.2 TP43.1 U5.15(OUT) U5.16(OUT) U6.3(VIN)
DVDT: C56.1 U5.12(dVdT)
EN: R61.1 R62.2 U6.5(EN)
FB: C59.2 R107.1 R111.2 TP46.1 U6.4(FB)
FLT: R30.1 U5.14(~{FLT})
ILIM: R60.2 U5.11(ILIM)
IMON: R59.2 TP47.1 U5.10(IMON) U7.1(VIN+)
OVP: R57.1 R58.2 U5.5(OVP)
PF11: C95.1 R119.2 ; port VIN_MON
PF12: C93.1 R114.2 ; port EFUSE_IMON
POWER_INPUT: C35.1 C36.1 C37.1 D1.2 D12.2(A) R56.2 U5.1(IN) U5.2(IN) ; port POWER_INPUT
SW: C84.2 L1.1 TP44.1 U6.2(SW)
UVLO: R56.1 R57.2 U5.3(UVLO)
NetC84_1: C84.1 U6.6(BOOT)
NetD7_1: D7.1(K) R112.2
NetD8_1: D8.1(K) R122.2
NetD12_1: D12.1(K) R30.2
NetQ5_1: Q5.1(G) R121.2 R123.2
NetQ5_3: Q5.3(D) R120.2 U10.3(ON)
NetR114_1: R114.1 U7.3(VIN-) U7.4(VOUT)
NetR117_1: R117.1 R118.1 U9.1(VIN+)
NetR119_1: R119.1 U9.3(VIN-) U9.4(VOUT)

Not connected (* = marked no-connect by the designer): U2 3(NC_1)* 7(NC_2)*; U5 4(NC)* 6(MODE)* 7(~{SHDN})* 13(NC)*; U8 4(CT)* 5(QOD)*; U10 4(CT)* 5(QOD)*

### Library data of the parts
C34 = CMP-13271-000835-1: Cap Ceramic 2.2uF 16V X5R ±10% Pad SMD 0603 +85°C T/R; Case Code (Metric): 1608; Height: 0.8mm; Case/Package: 0603; Depth: 0.8mm; Case Code (Imperial): 0603; Length: 1.6mm; Packaging: Tape and Reel; Material: Ceramic; Lead Free: Lead Free; Max Operating Temperature: 85°C; Contact Plating: Tin; Thickness: 0.035inch; Radiation Hardening: No; Tolerance: 10%; Min Operating Temperature: -55°C; Voltage: 16V; Dielectric: X5R; Mount: Surface Mount; Package Quantity: 4000; Width: 0.031inch; Voltage Rating (DC): 16V
C35 C84 C92-C95 = CMP-2006-03068-2: CAP CER 0.1UF 50V 20% X7R 0603; Manufacturer: KEMET; Material: Ceramic; Tolerance: 0.2; Temperature Coefficient: 30ppm/°C; Automotive Grade: Grade 1; Capacitance: 0.10 μF; Temperature Range High: +125°C; Device Class L3: Ceramic Capacitors; Manufacturer Part Number: C0603C104M5RACTU; Height: 0.87mm; Category: Cap; RoHS: TRUE; Digikey Description: CAP CER 0.1UF 50V 20% X7R 0603; ComponentLink2URL: https://api.kemet.com/component-edge/download/datasheet/C0603C100J5GACAUTO.pdf; Lead Free: Yes; Temperature Range Low: -55°C; Device Class L1: Passive Components; ComponentLink2Description: Datasheet; Temperature Characteristic: X7R; Automotive: Yes; Temperature: -55°C to +125°C; Octopart: https://octopart.com/c0603c104m5ractu-kemet-11855687; Device Class L2: Capacitors; Package: C0603C-CF; Mouser Description: Multilayer Ceramic Capacitors MLCC - SMD/SMT 50volts 0.1uF X7R 20%
C36 C37 = CMP-13271-000016-1: CAP CER 10UF 50V X5R 1206; Manufacturer: Samsung; Tolerance: 10%; Material: Ceramic; Temperature Coefficient: 15%; RoHS: TRUE; Ipc Land Pattern Name: CAPC320160X160; Temperature Range Low: -55°C; Value: 10uF; Device Class L3: Ceramic Capacitors; Category: Cap; Temperature Characteristic: X5R; Lead Free: Yes; Device Class L2: Capacitors; Octopart: https://octopart.com/cl31a106kbhnnne-samsung-19832778; ComponentLink2Description: Datasheet; Digikey Description: CAP CER 10UF 50V X5R 1206; ComponentLink2URL: http://www.samsungsem.com/kr/support/product-search/mlcc/__icsFiles/afieldfile/2018/06/21/CL31A106KBHNNNE.pdf; Manufacturer Part Number: CL31A106KBHNNNE; Temperature Range High: +85°C; Device Class L1: Passive Components; Height: 1.8mm; Automotive: No; Voltage Rating: 50V; Package: CL31; Temperature: -55°C to +85°C
C39 C58 = CMP-1662-00023-3: Chip Multilayer Ceramic Capacitors for General Purpose, 1210, 47uF, X7R, 15%, 10%, 10V; Case Code (Metric): 3225; REACH SVHC: No SVHC; Depth: 2.5mm; Termination: SMD/SMT; Width: 2.5mm; Number of Pins: 2; Mount: Surface Mount; Case Code (Imperial): 1210; Package Quantity: 1; Thickness: 0.106inch; Height: 2.5mm; Length: 3.2mm; Case/Package: 1210; Packaging: Tape and Reel; Lead Free: Lead Free; Radiation Hardening: No; Dielectric: X7R; Tolerance: 10%; Max Operating Temperature: 125°C; Voltage: 10V; Material: Ceramic; Min Operating Temperature: -55°C; Voltage Rating (DC): 10V
C56 C96 = CMP-2006-02363-4: Manufacturer Lifecycle Status: IN PRODUCTION; NexarPartId: 18909256; Dielectric: X7R; Material: Ceramic; Tolerance: 10%; Thickness: 889µm; Max Operating Temperature: 125°C; Radiation Hardening: No; Weight: 6.293594mg; Lead Free: Lead Free; Mount: Surface Mount; Case Code (Imperial): 0603; REACH SVHC: No SVHC; Lifecycle Status: Production; Depth: 800µm; Min Operating Temperature: -55°C; Height: 800µm; Case Code (Metric): 1608; Case/Package: 0603; Voltage: 25V; Packaging: Cut Tape; Length: 1.6mm; Termination: SMD/SMT; Width: 787.4µm; Voltage Rating (DC): 25V; RoHS: Compliant; Schedule B: 8532240020, 8532240020; Ratings: AEC-Q200
C59 = CMP-2006-03408-2: CAP CER 100PF 50V C0G/NP0 0603; Manufacturer: KEMET; Material: Ceramic; Tolerance: 0.05; Automotive Grade: Grade 1; Temperature Coefficient: 30ppm/°C; Temperature Characteristic: C0G; RoHS: TRUE; Temperature Range Low: -55°C; Automotive: Yes; Digikey Description: CAP CER 100PF 50V C0G/NP0 0603; Lead Free: Yes; Category: Cap; Manufacturer Part Number: C0603C101J5GACTU; Device Class L3: Ceramic Capacitors; Mouser Description: Multilayer Ceramic Capacitor, C Series, 100 Pf, - 5%, C0g / Np0, 50 V, 0603 [1608 Metric] Rohs Compliant: Yes; Value: 100 pF; Device Class L1: Passive Components; Temperature: -55°C to +125°C; ComponentLink2URL: https://api.kemet.com/component-edge/download/datasheet/C0603C100J5GACAUTO.pdf; Temperature Range High: +125°C; ComponentLink2Description: Datasheet; Octopart: https://octopart.com/c0603c101j5gactu-kemet-100052; Device Class L2: Capacitors; Height: 0.87mm; Package: C0603C-CF
C85-C87 = CMP-06035-048920-1: Chip Multilayer Ceramic Capacitors for General Purpose, 0805, 10uF, X5R, 15%, 10%, 35V; Max Operating Temperature: 85°C; REACH SVHC: No SVHC; Packaging: Tape and Reel; Thickness: 0.057inch; Tolerance: 10%; Case Code (Imperial): 0805; Height: 1.25mm; Width: 0.049inch; Length: 0.079inch; Lead Free: Lead Free; Case/Package: 0805; Dielectric: X5R; Min Operating Temperature: -55°C; Package Quantity: 3000; Termination: SMD/SMT; Case Code (Metric): 2012; Weight: 0.000335oz; Mount: Surface Mount; Voltage Rating (DC): 35V
C98 = CMP-2000-05442-2: CAP CER 10UF 25V X5R 0603; Dielectric Material: Ceramic; Tolerance: 20%; Dielectric: X5R; Length: 1.6mm; Termination: SMD/SMT; Depth: 0.8mm; RoHS Compliant: Yes; Construction: Flat; Weight: 7.1E-05oz; Thickness: 0.039inch; Packaging: Tape and Reel; Min Operating Temperature: -55°C; Case Code (Imperial): 0603; Case/Package: 0603; Height: 0.8mm; Case Code (Metric): 1608; Resistor Type: Ceramic; Voltage Rating (DC): 25V; Max Operating Temperature: 85°C; REACH SVHC: No SVHC; Lead Free: Lead Free; Series: C; Width: 0.8mm; Mount: Surface Mount; Package Quantity: 1
D1 = SMBJ30CA: TVS Diode (Bi-directional); Manufacturer_Name: LITTELFUSE; Datasheet Link: https://componentsearchengine.com/Datasheets/2/SMBJ30CA.pdf; Height: 2.44mm; Manufacturer_Part_Number: SMBJ30CA; Mouser Part Number: 576-SMBJ30CA; Mouser Price/Stock: https://www.mouser.co.uk/ProductDetail/Littelfuse/SMBJ30CA?qs=HR2RnyOI4E5ZKjtlv2hDrQ%3D%3D; Arrow Part Number: SMBJ30CA; Arrow Price/Stock: https://www.arrow.com/en/products/smbj30ca/littelfuse?region=nac; Supplier 1: Future Electronics; Supplier Part Number 1: 1031707
D7 D8 = CMP-1426-00006-6: NexarPartId: 29717778; Reverse Voltage: 5V; Forward Voltage: 2V; Viewing Angle: 140°; Luminous Intensity: 40mcd; Test Current: 20mA; Max Junction Temperature (Tj): 95°C; Wavelength: 570nm; Forward Current: 100mA; Color: Green; Lens Style: Clear, Rectangular; Power Dissipation: 72mW; Peak Wavelength: 572nm; Packaging: Tape and Reel; REACH SVHC: Unknown; Width: 800µm; Max Operating Temperature: 85°C; Number of Pins: 2; RoHS: Compliant; Dominant Wavelength: 570nm; Min Operating Temperature: -40°C; Case Code (Imperial): 0603; Height: 700µm; Length: 1.6mm; Case Code (Metric): 1608; Case/Package: 0603; Max Reverse Voltage (DC): 5V; Mount: Surface Mount
D12 = CMP-1426-00001-3: NexarPartId: 29717776; Color: Red; Power Dissipation: 72mW; Max Reverse Voltage (DC): 5V; Peak Wavelength: 630nm; Viewing Angle: 140°; Forward Voltage: 2V; Luminous Intensity: 250mcd; Forward Current: 100mA; Dominant Wavelength: 625nm; Lens Style: Clear, Rectangular; Max Junction Temperature (Tj): 95°C; Test Current: 20mA; Mount: Surface Mount; Packaging: Tape and Reel; Case Code (Metric): 1608; Max Operating Temperature: 85°C; Case Code (Imperial): 0603; REACH SVHC: Unknown; Width: 800µm; Length: 1.6mm; Reverse Voltage: 5V; Height: 700µm; Case/Package: 0603; RoHS: Compliant; Wavelength: 625nm; Min Operating Temperature: -40°C
L1 = CMP-2000-07148-2: FIXED IND 33UH 3.5A 57 MOHM SMD; Self Resonant Frequency: 9.5MHz; Saturation Current: 3.3A; Shielding: Shielded; Test Frequency: 100kHz; Core Material: Ferrite; Tolerance: 20%; Q Factor: 28; Resistance: 57MR; Material: Steel; RMS Current (Irms): 3.5A; Max DC Current: 3.5A; Height: 7.5mm; Frequency: 9.5MHz; Series: SRR1280; Length: 12.5mm; Military Standard: Not; Height - Seated (Max): 0.315inch; REACH SVHC: No SVHC; DC Current: 3.5A; Current Rating: 3.5A; Sample Rate (Hz): 100kHz; Min Operating Temperature: -40°C; RoHS Compliant: Yes; Width: 12.5mm; Packaging: Tape and Reel; Inductance Tolerance: 20%; Case/Package: Nonstandard; Radiation Hardening: No; Max Operating Temperature: 125°C; Number of Pins: 2; Depth: 12.8mm; Mount: Surface Mount; Termination: SMD/SMT; Package Quantity: 400; DC Resistance (DCR): 57mR; Resistor Type: Wirewound
Q5 = CMP-2000-04929-2: MOSFET N-CH 60V 115MA SOT23-3; Turn-On Delay Time: 7ns; Turn-Off Delay Time: 11ns; Drain to Source Resistance: 7.5R; Rise Time: 3ns; Drain to Source Breakdown Voltage: 70V; Input Capacitance: 50pF; Number of Elements: 1; Power Dissipation: 540mW; Max Power Dissipation: 300mW; Fall Time: 5.6ns; Gate to Source Voltage (Vgs): 20V; Threshold Voltage: 2.5V; Element Configuration: Single; Termination: SMD/SMT; Weight: 0.000282oz; Radiation Hardening: No; Max Operating Temperature: 150°C; On-State Resistance: 7.5R; Mount: Surface Mount; Current Rating: 115mA; Contact Plating: Tin; Lead Free: Lead Free; Min Operating Temperature: -55°C; Number of Pins: 3; REACH SVHC: No SVHC; Drain to Source Voltage (Vdss): 60V; Width: 1.3mm; Package Quantity: 3000; Length: 2.9mm; Case/Package: SOT-23; Number of Channels: 1; Dual Supply Voltage: 60V; Packaging: Tape and Reel; Height: 1mm; Voltage Rating (DC): 60V; Nominal Vgs: 2.5V; Continuous Drain Current (ID): 115mA; Voltage: 60V; Rds On Max: 7.5R
R30 = CMP-2000-04835-3: RES 2.2KΩ 1.00% 0.1W 0603; Tolerance: 1%; Max Power Dissipation: 100mW; Temperature Coefficient: 100ppm/°C; Voltage Rating: 50V; Features: Moisture Resistant; Size Code: 0603; Termination: SMD/SMT; Packaging: Tape and Reel; Min Operating Temperature: -55°C; Case/Package: 0603; Width: 0.031inch; Case Code (Metric): 1608; Package Quantity: 1; Height: 0.022inch; Number of Terminations: 2; Depth: 0.8mm; Construction: Rectangular; Power Rating: 100mW; Ratings: AEC-Q200; Series: AC; Case Code (Imperial): 0603; RoHS Compliant: Yes; Resistor Type: Thick Film; Military Standard: Not; Length: 0.063inch; Max Operating Temperature: 155°C; Lead Free: Lead Free
R56 = CMP-2000-00592-1: Manufacturer: Panasonic; Part Number: ERJ-3EKF6193V
R57 = CMP-2000-00605-1: Manufacturer: Panasonic; Part Number: ERJ-3EKF6492V
R58 = CMP-2000-00417-2: RES SMD 30.1K OHM 1% 1/10W 0603; Power Rating: 100mW; Temperature Coefficient: 100ppm/°C; Voltage Rating: 75V; Voltage Rating (DC): 50V; Case Code (Metric): 1608; REACH SVHC: No SVHC; Series: ERJ; Height: 0.022inch; Contact Plating: Tin; Number of Terminations: 2; Radiation Hardening: No; Tolerance: 1%; Length: 1.6mm; Case/Package: 0603; Features: Automotive AEC-Q200; Max Operating Temperature: 155°C; Termination: SMD/SMT; Mount: Surface Mount; Max Power Dissipation: 100mW; Width: 0.031inch; Resistor Type: Thick Film; Depth: 0.8mm; Lead Free: Lead Free; Min Operating Temperature: -55°C; Construction: Rectangular; Package Quantity: 1; RoHS Compliant: Yes; Resistance Tolerance: 1%; Case Code (Imperial): 0603; Packaging: Tape and Reel; Military Standard: Not
R59 = CMP-2000-03133-2: RES Thick Film, 26.1kΩ, 1%, 0.1W, 100ppm/°C, 0603; Power Rating: 100mW; Voltage Rating (DC): 75V; Width: 0.033inch; Lead Free: Lead Free; Number of Pins: 2; Package Quantity: 10; Length: 1.55mm; Max Power Dissipation: 100mW; Working Voltage: 75V; Contact Plating: Tin; Features: Automotive AEC-Q200; Case/Package: 0603; Depth: 0.85mm; Min Operating Temperature: -55°C; Tolerance: 1%; Height: 0.45mm; Case Code (Imperial): 0603; Military Standard: Not; Packaging: Tape and Reel; Number of Terminations: 2; Case Code (Metric): 1608; Max Operating Temperature: 155°C; Termination: SMD/SMT; Weight: 7.1E-05oz; Composition: Thick Film; Voltage Rating: 75V; Temperature Coefficient: 100ppm/°C
R60 R118 R120 = CMP-2100-03664-2: RES 10K OHM 1% 1/10W 0603; Voltage Rating: 75V; Voltage Rating (DC): 50V; Power Rating: 100mW; Temperature Coefficient: 100ppm/°C; Depth: 0.8mm; Termination: SMD/SMT; Resistor Type: Thick Film; Series: RC; Construction: Rectangular; Features: Moisture Resistant; Packaging: Tape and Reel; Min Operating Temperature: -55°C; Number of Terminations: 2; Lead Pitch: 0.3mm; RoHS Compliant: Yes; Case/Package: 0603; Resistance Tolerance: 1%; Military Standard: Not; Weight: 7.1E-05oz; Number of Pins: 2; Tolerance: 1%; Length: 1.6mm; Case Code (Imperial): 0603; Lead Free: Lead Free; Width: 0.8mm; Max Power Dissipation: 100mW; Height: 0.45mm; Max Operating Temperature: 155°C; Case Code (Metric): 1608; Size Code: 0603
R61 = CMP-03412-037815-1: RES SMD 105K OHM 1% 1/10W 0603; Max Power Dissipation: 100mW; Temperature Coefficient: 100ppm/°C; Voltage Rating: 75V; Voltage Rating (DC): 50V; RoHS Compliant: Yes; Lead Free: Lead Free; Case Code (Metric): 1608; Length: 1.6mm; Case/Package: 0603; Min Operating Temperature: -55°C; Weight: 7.1E-05oz; Resistor Type: Thick Film; Case Code (Imperial): 0603; Number of Terminations: 2; Power Rating: 100mW; Construction: Rectangular; Features: Moisture Resistant; Width: 0.031inch; Tolerance: 1%; Package Quantity: 1; Military Standard: Not; Height: 0.45mm; Size Code: 0603; Packaging: Tape and Reel; Mount: Surface Mount; Max Operating Temperature: 155°C; Depth: 0.8mm; Termination: SMD/SMT; Series: RC; Technology: THICK FILM
R62 = CMP-2000-04074-1: Manufacturer: Yageo; Part Number: RC0603FR-07511KL
R107 R117 R123 = CMP-2000-03822-2: RES Thick Film, 100kΩ, 1%, 0.1W, 100ppm/°C, 0603; Power Rating: 100mW; Height: 0.02inch; Min Operating Temperature: -55°C; Length: 0.061inch; Temperature Coefficient: 100ppm/°C; Number of Terminations: 2; Packaging: Tape and Reel; Case Code (Imperial): 0603; Case/Package: 0603; Contact Plating: Tin; Radiation Hardening: No; Lead Free: Lead Free; Depth: 0.85mm; Case Code (Metric): 1608; Max Power Dissipation: 100mW; Features: Automotive AEC-Q200; Tolerance: 1%; Max Operating Temperature: 155°C; Composition: Thick Film; Military Standard: Not; Width: 0.033inch
R111 = CMP-2000-00242-2: NexarPartId: 55411167; Voltage Rating: 75V; Temperature Coefficient: 100ppm/°C; Max Power Dissipation: 100mW; Tolerance: 1%; Voltage Rating (DC): 50V; Height: 558.8µm; Lead Free: Lead Free; RoHS: Compliant; Composition: Thick Film; Schedule B: 8533210045, 8533210045; Case Code (Imperial): 0603; Case/Package: 0603; Features: Automotive AEC-Q200; Length: 1.6mm; Packaging: Cut Tape (CT); Case Code (Metric): 1608; Number of Terminations: 2; Power Rating: 100mW; Width: 787.4µm; Termination: SMD/SMT; Mount: Surface Mount; Lifecycle Status: Production; REACH SVHC: Unknown; Depth: 800µm; Military Standard: Not; Min Operating Temperature: -55°C; Contact Plating: Tin; Max Operating Temperature: 155°C
R112 = CMP-1012-00454-3: RES Thick Film, 330Ω, 1%, 0.1W, 100ppm/°C, 0603; Voltage Rating: 75V; Max Power Dissipation: 100mW; Depth: 0.85mm; Contact Plating: Tin; Package Quantity: 10; Termination: SMD/SMT; Tolerance: 1%; Height: 0.45mm; Number of Terminations: 2; Radiation Hardening: No; Features: Automotive AEC-Q200; Case/Package: 0603; Mount: Surface Mount; Case Code (Metric): 1608; Lead Free: Lead Free; Temperature Coefficient: 100ppm/°C; Weight: 7.1E-05oz; Military Standard: Not; Packaging: Tape and Reel; Max Operating Temperature: 155°C; Voltage Rating (DC): 75V; Length: 1.55mm; Min Operating Temperature: -55°C; Composition: Thick Film; Case Code (Imperial): 0603; Width: 0.033inch; Power Rating: 100mW
R114 R119 R121 = CMP-2000-04828-3: RES 1kΩ 1.00% 0.1W 0603; Voltage Rating: 50V; Power Rating: 100mW; Tolerance: 1%; Temperature Coefficient: 100ppm/°C; Depth: 0.8mm; Case/Package: 0603; Size Code: 0603; Case Code (Metric): 1608; Height: 0.022inch; Series: AC; Width: 0.031inch; Construction: Rectangular; Length: 0.063inch; Case Code (Imperial): 0603; Package Quantity: 1; RoHS Compliant: Yes; Features: Moisture Resistant; Resistor Type: Thick Film; Max Power Dissipation: 100mW; Packaging: Tape and Reel; Termination: SMD/SMT; Ratings: AEC-Q200; Max Operating Temperature: 155°C; Min Operating Temperature: -55°C; Military Standard: Not; Lead Free: Lead Free; Number of Terminations: 2
R122 = CMP-2000-03913-2: RES Thick Film, 150Ω, 1%, 0.1W, 100ppm/°C, 0603; Voltage Rating (DC): 75V; Max Power Dissipation: 100mW; Features: Automotive AEC-Q200; Weight: 7.1E-05oz; Number of Terminations: 2; Temperature Coefficient: 100ppm/°C; Military Standard: Not; Length: 1.55mm; Min Operating Temperature: -55°C; Termination: SMD/SMT; Tolerance: 1%; Composition: Thick Film; Depth: 0.85mm; Max Operating Temperature: 155°C; Width: 0.033inch; Lead Free: Lead Free; Height: 0.45mm; Case Code (Metric): 1608; Package Quantity: 10; Case Code (Imperial): 0603; Voltage Rating: 75V; Radiation Hardening: No; Contact Plating: Tin; Mount: Surface Mount; Packaging: Tape and Reel; Power Rating: 100mW; Case/Package: 0603
TP43-TP49 = CMP-1672-00008-1: Test Point, 1 Position SMD, RoHS, Tape and Reel; ComponentLink1Description: Manufacturer URL; Package Quantity: 1000; DatasheetVersion: 03/2014; Packaging: Tape and Reel; ComponentLink2URL: http://www.keyelco.com/product-pdf.cfm?p=1357; ComponentLink1URL: http://www.keyelco.com/; Mount: Surface Mount; Contact Plating: Silver; PackageDescription: 1-Pin Surface Mount Device, Body 3.81 x 2.03 mm; Pins: 1; RoHSCompliant: True; Mounting Technology: Surface Mount; ComponentLink2Description: Datasheet; PackageReference: 5019
U2 = TLV76733DGNR: Integrated Circuit; Manufacturer_Name: Texas Instruments; Datasheet Link: https://www.ti.com/lit/ds/symlink/tlv767.pdf?ts=1601893180135&ref_url=https%253A%252F%252Fduckduckgo.com%252F; Height: 1.1mm; Manufacturer_Part_Number: TLV76733DGNR; Mouser Part Number: 595-TLV76733DGNR; Mouser Price/Stock: https://www.mouser.co.uk/ProductDetail/Texas-Instruments/TLV76733DGNR?qs=W%2FMpXkg%252BdQ7WCurh%2FfEdlw%3D%3D; Arrow Part Number: TLV76733DGNR; Arrow Price/Stock: https://www.arrow.com/en/products/tlv76733dgnr/texas-instruments?region=nac
U5 = CMP-04910-000010-1: IC PWR MGMT EFUSE 60V 16HTSSOP; Manufacturer: Texas Instruments; Number Of Outputs: 1; Nominal Supply Current: 300uA; Min Supply Voltage: 4.2V; Max Junction Temp: +125°C; Standoff Height: 0.05mm; Output Voltage: 2.7V; Device Class L1: Integrated Circuits (ICs); RoHS: TRUE; ComponentLink2Description: Datasheet; Temperature Range Low: -40°C; Max Supply Voltage: 60V; Category: IC; Mouser Description: 60V 2A Industrial eFuse With Integrated Reverse-Input Polarity Protection 16-HTSSOP -40 to 125; Ipc Land Pattern Name: SOP65P640X120-16; Temperature Range High: +125°C; Height: 1.2mm; Package: PWP0016H; Automotive: No; Device Class L2: Power Management ICs; Octopart: https://octopart.com/tps26600pwpr-texas+instruments-75302671; Digikey Description: IC PWR MGMT EFUSE 60V 16HTSSOP; Temperature: -40°C to +125°C; ComponentLink2URL: http://www.ti.com/general/docs/suppproductinfo.tsp?distId=10&gotoUrl=http%3A%2F%2Fwww.ti.com%2Flit%2Fgpn%2Ftps2660; Device Class L3: unset; Lead Free: Yes; Manufacturer Part Number: TPS26600PWPR
U6 = CMP-04918-000439-1: IC REG BUCK ADJ 2A TSOT23-6; Switching Frequency: 500kHz; Quiescent Current: 40uA; Max Output Voltage: 28V; Output Configuration: Positive; Min Output Voltage: 596mV; Min Input Voltage: 4.5V; Synchronous Rectifier: Yes; Output Type: Adjustable; Number of Outputs: 1; Packaging: Tape and Reel; Case/Package: SOT-23-6; RoHS Compliant: Yes; Max Input Voltage: 28V; Max Operating Temperature: 125°C; Min Operating Temperature: -40°C; Output Current: 2A; Lead Free: Lead Free; Mount: Surface Mount
U7 U9 = CMP-00252-107945950-1: MCP6V76UT-E/OT Operational Amplifier Zero-Drift 170uA 2MHz 2V to 5.5V 1V/us 5-Pin SOT-23 T/R; Input Offset Voltage (Vos): 25µV; Max Junction Temperature (Tj): 150°C; Number of Channels: 1; Output Current per Channel: 26mA; Input Bias Current: 10pA; Max Supply Voltage: 5.5V; Case/Package: SOT-23-5; Min Supply Voltage: 2V; Min Operating Temperature: -40°C; NexarPartId: 107945950; Max Operating Temperature: 125°C; Schedule B: 8542330000, 8542330000; Lifecycle Status: Production; Height: 1.45mm
U8 U10 = CMP-04912-000029-1: IC PWR SWITCH P-CHAN 1:1 SOT23-6; Number of Outputs: 1; Output Configuration: High Side; Fault Protection: Reverse Current; Interface: On/Off; Max Output Current: 2A; Max Operating Temperature: 125°C; Case/Package: SOT-23-6; Packaging: Tape and Reel; Number of Channels: 1; Min Operating Temperature: -40°C